# EAGLE design isp (EAGLE 6.1)
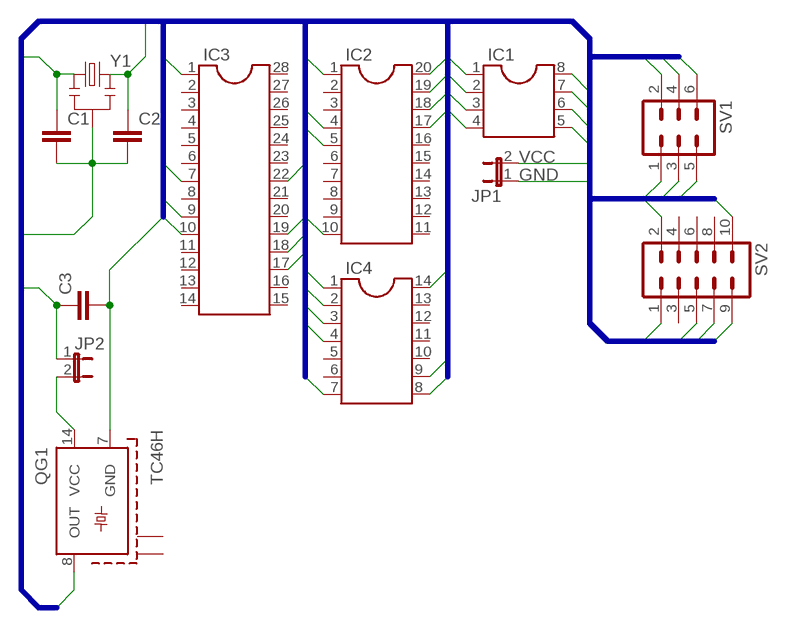
[diagram p0: schematic, sheet 1]

## Parts
C1  C-EU025_050-025X075  [C025_050-025X075]
C2  C-EU025_050-025X075  [C025_050-025X075]
C3  C-EU025-024X044  [C025-024X044]
IC1  DIL8  [DIL08]
IC2  DIL20  [DIL20]
IC3  DIL28-3  [DIL28-3]
IC4  DIL14  [DIL14]
JP1  JP1E  [JP1]
JP2  JP1E  [JP1]
QG1  TC46H  [TC46]
SV1  ML6  [ML6]
SV2  ML10  [ML10]
Y1  RESONATORPTH  [RESONATOR-PTH]

## Nets
GND: C1.2 C2.2 C3.2 IC1.4 IC2.10 IC3.22 IC4.14 JP1.1 QG1.7(GND) SV1.6 SV2.10 Y1.2
MISO: IC1.6 IC2.18 IC3.18 IC4.8 SV1.1 SV2.9
MOSI: IC1.5 IC2.17 IC3.17 IC4.7 SV1.4 SV2.1
N$1: JP2.2 QG1.14(VCC)
RESET: IC1.1 IC2.1 IC3.1 IC4.4 SV1.5 SV2.5
SCK: IC1.7 IC2.19 IC3.19 IC4.9 SV1.3 SV2.7
VCC: C3.1 IC1.8 IC2.20 IC3.7 IC4.1 JP1.2 JP2.1 SV1.2 SV2.2
XTAL1: C1.1 IC1.2 IC2.4 IC3.9 IC4.2 QG1.8(OUT) Y1.1
XTAL2: C2.1 IC1.3 IC2.5 IC3.10 IC4.3 Y1.3
Unconnected: IC2.2 IC2.3 IC2.6 IC2.7 IC2.8 IC2.9 IC2.11 IC2.12 IC2.13 IC2.14 IC2.15 IC2.16 IC3.2 IC3.3 IC3.4 IC3.5 IC3.6 IC3.8 IC3.11 IC3.12 IC3.13 IC3.14 IC3.15 IC3.16 IC3.20 IC3.21 IC3.23 IC3.24 IC3.25 IC3.26 IC3.27 IC3.28 IC4.5 IC4.6 IC4.10 IC4.11 IC4.12 IC4.13 QG1.S@1(S1) QG1.S@2(S2) SV2.3 SV2.4 SV2.6 SV2.8

## Buses
LINE:MOSI,MISO,RESET,SCK,VCC,GND,XTAL1,XTAL2

## Library data of the parts
C1-C3 = rcl:C-EU: CAPACITOR, European symbol
IC1 = ic-package:DIL8: Dual In Line / Socket
IC2 = ic-package:DIL20: Dual In Line / Socket
IC3 = ic-package:DIL28: Dual In Line
IC4 = ic-package:DIL14: Dual In Line / Socket
JP1 JP2 = jumper:JP1E: JUMPER
QG1 = crystal:TC46: Temperature Compensated Xtal Oscillator HCMOS, Clipped Sine Wave or Sine Wave Compatible Source: www.pletronics.com .. tc4.pdf; OC_FARNELL: unknown; OC_NEWARK: unknown
SV1 = con-harting-ml:ML6: HARTING
SV2 = con-harting-ml:ML10: HARTING
Y1 = SparkFun-FreqCtrl:RESONATOR: Resonator Small SMD resonator. Used, eg, on the Arduino Pro/ Pro Mini boards. 8MHz- XTAL-08895 16MHz- XTAL-08900

## Board
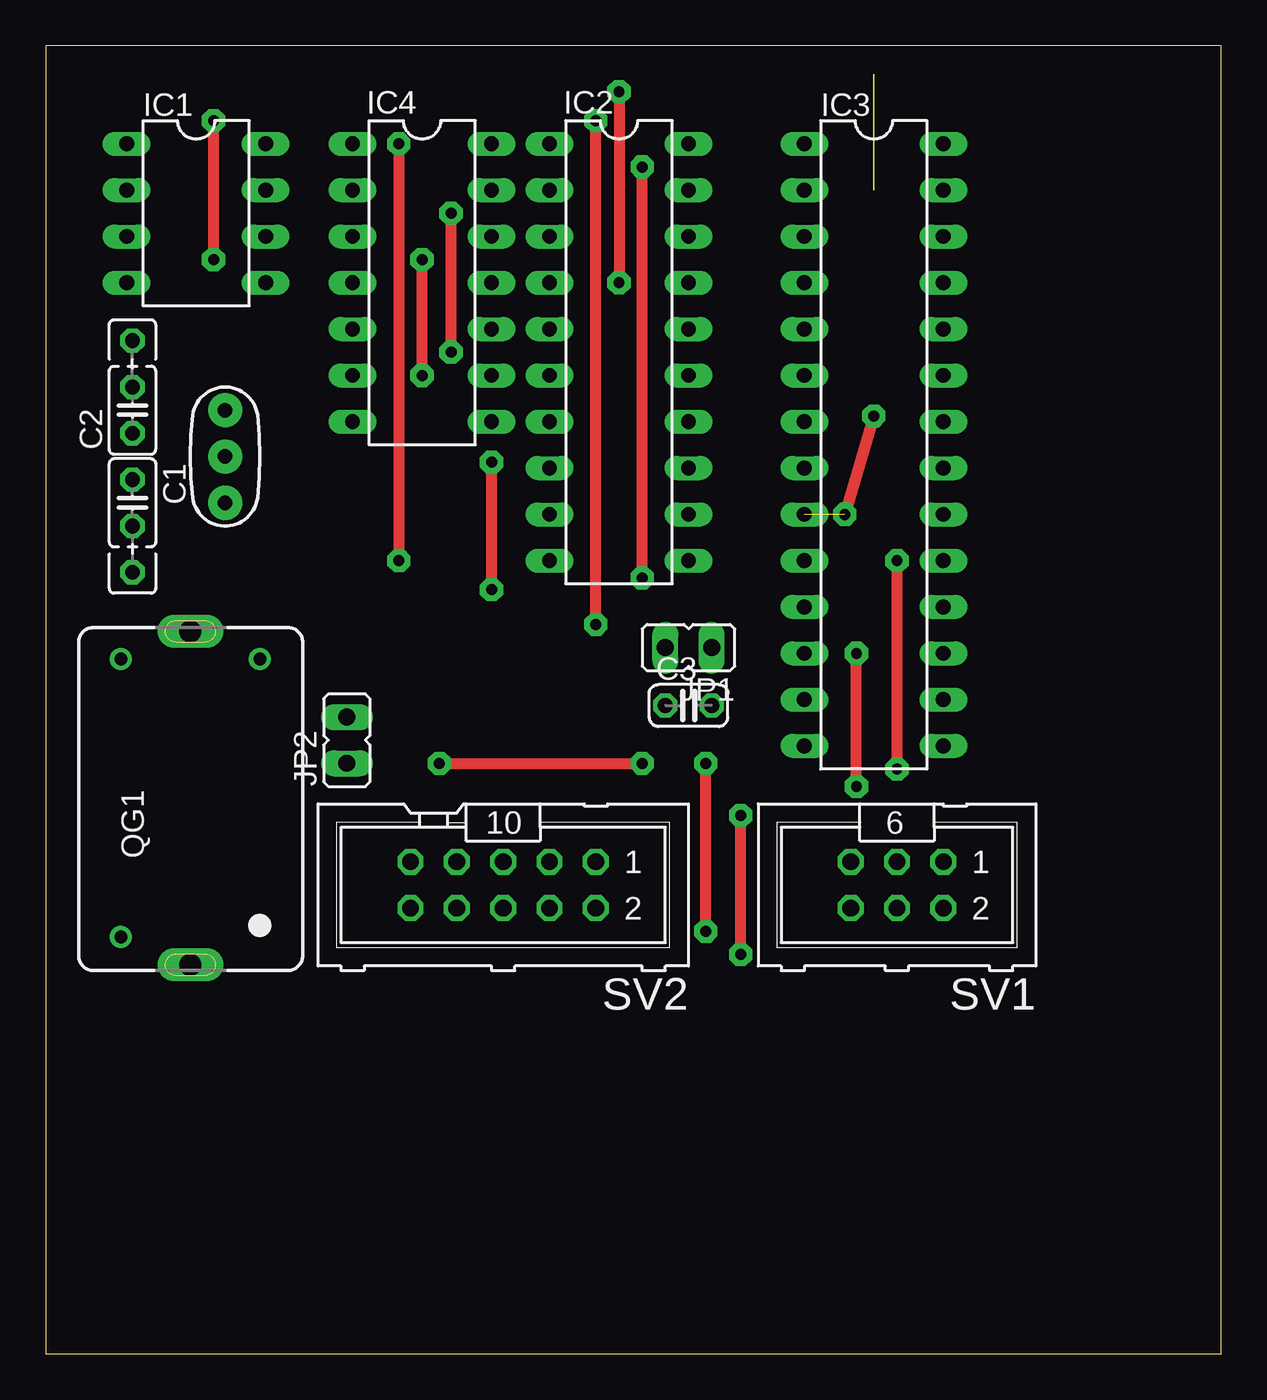
[diagram p1: board, top side]
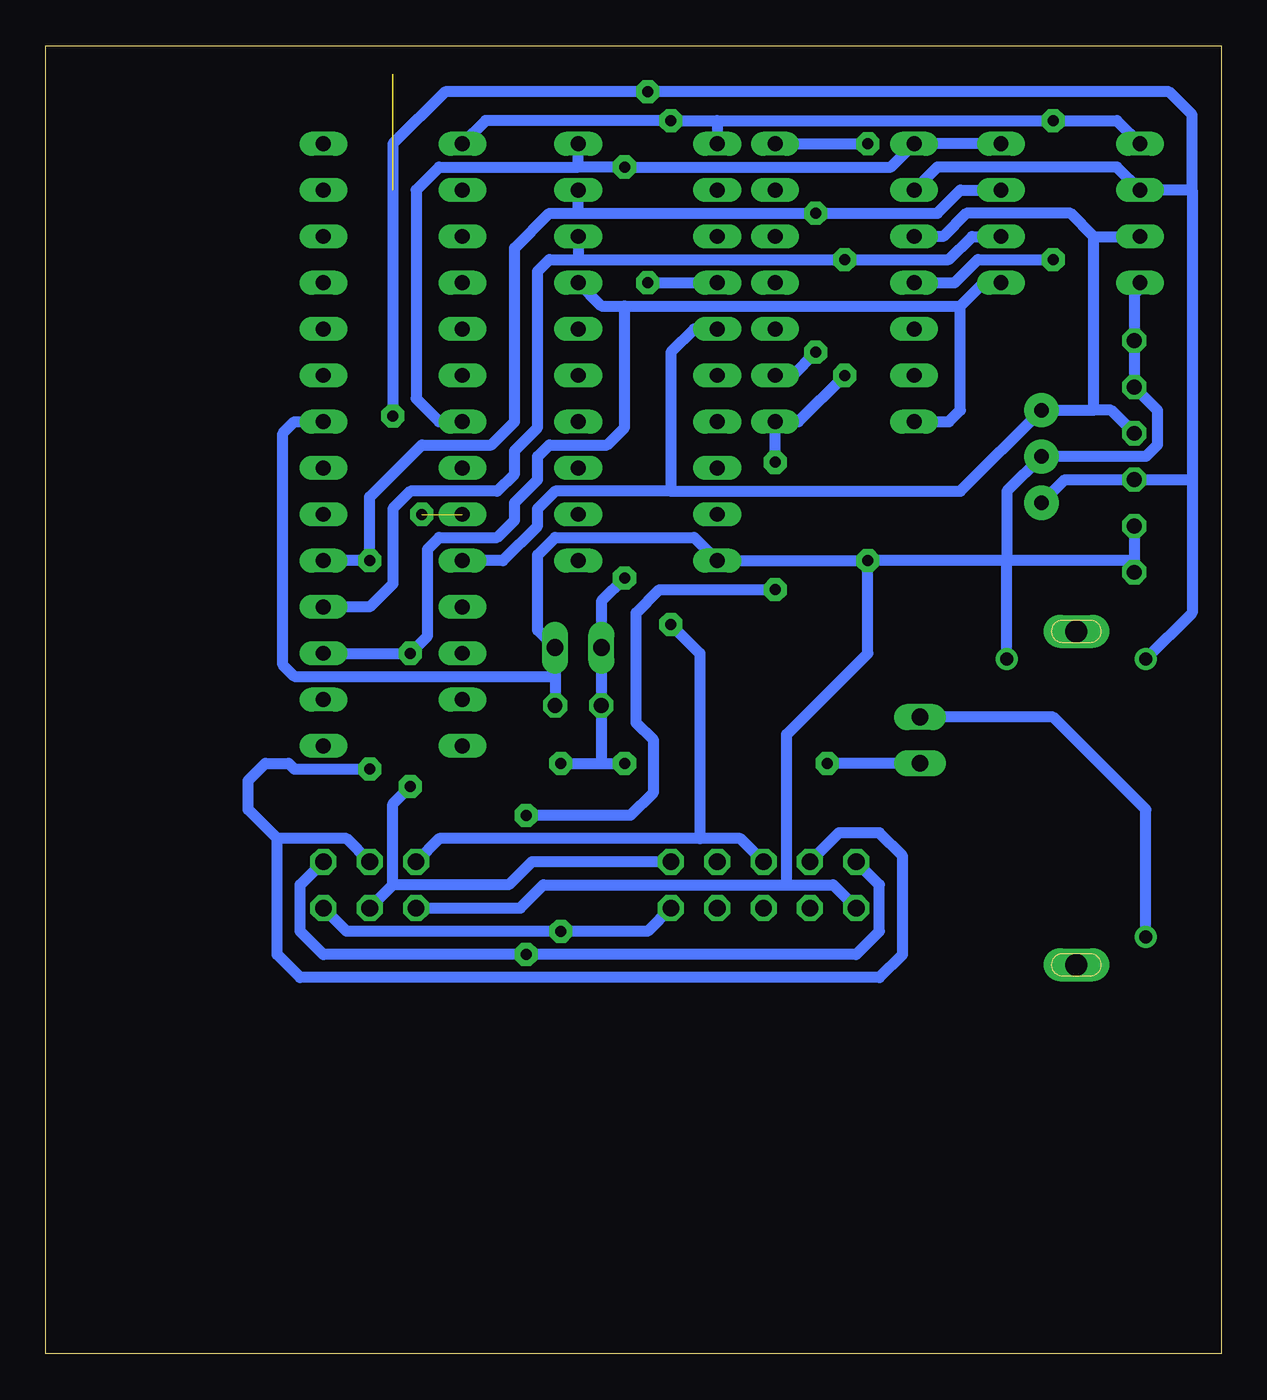
[diagram p2: board, bottom side, seen from below]

Size 64.44 x 71.75 mm. Coordinates in mm from the lower left corner, seen from the top.
Outline: 0,0 64.44,0 64.44,71.75 0,71.75 0,0
Copper layers (1*16): Top 0.035mm / dielectric 1.5mm / Bottom 0.035mm
Design rules: minimum track width 10mil, minimum drill 24mil, track to track 12mil, track to pad 12mil, pad to pad 12mil, via to via 12mil, smd to smd 10mil, copper to edge 12mil, drill to drill 12mil, minimum pad ring 10mil, minimum via ring 10mil, stop-mask expansion 4mil, vias tented up to drill 0mil, thermal gap 12mil

### Footprints (pad centres in the part's own frame; a part is rotated, then mirrored left to right if it is on the bottom)
C025_050-025X075 = drill 0.813 octagon: 1 -1.27,0; 2 1.27,0; 3 3.81,0
C025-024X044 = drill 0.813 octagon: 1 -1.27,0; 2 1.27,0
DIL08 = drill 0.813 long: 1 -3.81,-3.81; 2 -1.27,-3.81; 3 1.27,-3.81; 4 3.81,-3.81; 5 3.81,3.81; 6 1.27,3.81; 7 -1.27,3.81; 8 -3.81,3.81
DIL20 = drill 0.813 long: 1 -11.43,-3.81; 2 -8.89,-3.81; 3 -6.35,-3.81; 4 -3.81,-3.81; 5 -1.27,-3.81; 6 1.27,-3.81; 7 3.81,-3.81; 8 6.35,-3.81; 9 8.89,-3.81; 10 11.43,-3.81; 11 11.43,3.81; 12 8.89,3.81; 13 6.35,3.81; 14 3.81,3.81; 15 1.27,3.81; 16 -1.27,3.81; 17 -3.81,3.81; 18 -6.35,3.81; 19 -8.89,3.81; 20 -11.43,3.81
DIL28-3 = drill 0.813 long: 1 -16.51,-3.81; 2 -13.97,-3.81; 3 -11.43,-3.81; 4 -8.89,-3.81; 5 -6.35,-3.81; 6 -3.81,-3.81; 7 -1.27,-3.81; 8 1.27,-3.81; 9 3.81,-3.81; 10 6.35,-3.81; 11 8.89,-3.81; 12 11.43,-3.81; 13 13.97,-3.81; 14 16.51,-3.81; 15 16.51,3.81; 16 13.97,3.81; 17 11.43,3.81; 18 8.89,3.81; 19 6.35,3.81; 20 3.81,3.81; 21 1.27,3.81; 22 -1.27,3.81; 23 -3.81,3.81; 24 -6.35,3.81; 25 -8.89,3.81; 26 -11.43,3.81; 27 -13.97,3.81; 28 -16.51,3.81
DIL14 = drill 0.813 long: 1 -7.62,-3.81; 2 -5.08,-3.81; 3 -2.54,-3.81; 4 0,-3.81; 5 2.54,-3.81; 6 5.08,-3.81; 7 7.62,-3.81; 8 7.62,3.81; 9 5.08,3.81; 10 2.54,3.81; 11 0,3.81; 12 -2.54,3.81; 13 -5.08,3.81; 14 -7.62,3.81
JP1 = drill 0.914 long: 1 0,-1.27; 2 0,1.27
TC46 = drill 0.7 pad 1.016: 7 7.62,-3.81; 8 7.62,3.81; 14 -7.62,3.81 | drill 1.2 pad 1.6 long: S@1 -9.144,0 | drill 1.2 pad 1.5 long: S@2 9.144,0
ML6 = drill 0.914 octagon: 1 -2.54,-1.27; 2 -2.54,1.27; 3 0,-1.27; 4 0,1.27; 5 2.54,-1.27; 6 2.54,1.27
ML10 = drill 0.914 octagon: 1 -5.08,-1.27; 2 -5.08,1.27; 3 -2.54,-1.27; 4 -2.54,1.27; 5 0,-1.27; 6 0,1.27; 7 2.54,-1.27; 8 2.54,1.27; 9 5.08,-1.27; 10 5.08,1.27
RESONATOR-PTH = drill 0.8 pad 1.88: 1 -2.54,0; 2 0,0; 3 2.54,0

### Placement (x,y rotation side)
C1  4.76,46.67 270 top
C2  4.76,51.75 90 top
C3  35.24,35.56 0 top
IC1  8.26,62.55 270 top
IC2  31.43,54.93 270 top
IC3  45.4,49.85 270 top
IC4  20.64,58.74 270 top
JP1  35.24,38.73 90 top
JP2  16.51,33.66 0 top
QG1  7.94,30.48 90 top
SV1  46.67,25.72 180 top
SV2  25.08,25.72 180 top
Y1  9.84,49.21 90 top

### Tracks (layer width: path | path; a pad name or v marks a point on that pad's centre or on a via)
GND  (via drill 0.6 pad 1.27)
  Top 0.61: v19.37,66.36 v19.37,43.5
  Bottom 0.61: SV2.10 21.27,25.72 23.81,25.72 | SV1.6 38.42,24.45 37.15,25.72 23.81,25.72 | IC1.4 4.13,58.74 4.76,58.1 C2.2 3.49,51.75 3.49,49.85 4.13,49.21 Y1.2 11.75,47.31 11.75,43.5 | v19.37,43.5 IC2.10 28.89,44.77 36.51,44.77 37.47,43.81 37.47,39.69 JP1.1 36.51,37.15 | IC4.14 v19.37,66.36 | 11.75,43.5 v19.37,43.5 | C1.2 4.76,43.5 | 4.76,42.86 4.76,43.5 | 4.76,43.5 11.75,43.5 | QG1.7 11.75,43.5 | 36.51,37.15 C3.2 | IC3.22 50.8,51.12 51.44,50.48 51.44,37.78 50.8,37.15 36.51,37.15 | 23.81,25.72 23.81,33.97 19.37,38.42 v19.37,43.5
MISO  (via drill 0.6 pad 1.27)
  Top 0.61: v38.1,21.91 v38.1,29.53 | v20.64,53.66 v20.64,60.01 | v24.45,41.91 v24.45,48.89
  Bottom 0.61: 35.24,60.01 36.83,60.01 37.47,59.37 37.47,50.8 38.73,49.53 38.73,48.26 39.69,47.31 44.45,47.31 45.4,46.36 45.4,42.23 46.67,40.96 IC3.18 | 35.24,60.01 v20.64,60.01 14.92,60.01 13.65,61.28 IC1.6 | SV2.9 18.73,25.72 18.73,23.18 20,21.91 v38.1,21.91 49.21,21.91 50.48,23.18 50.48,25.72 SV1.1 | v20.64,53.66 23.18,51.12 IC4.8 v24.45,48.89 | v24.45,41.91 30.8,41.91 32.07,40.64 32.07,34.61 31.11,33.66 31.11,30.8 32.38,29.53 v38.1,29.53 | IC2.18 35.24,60.01
MOSI  (via drill 0.6 pad 1.27)
  Top 0.61: v44.45,31.12 v44.45,38.42
  Bottom 0.61: 32.7,57.47 33.97,57.47 IC2.17 | 32.7,57.47 14.29,57.47 | 45.4,25.72 39.05,25.72 37.78,26.99 SV2.1 | 45.4,25.72 45.4,30.16 v44.45,31.12 | 45.4,25.72 SV1.4 | 14.29,57.47 13.02,58.74 IC1.5 | IC4.7 14.92,51.12 14.29,51.75 14.29,57.47 | IC3.17 v44.45,38.42 43.5,39.37 43.5,44.13 42.86,44.77 39.69,44.77 38.73,45.72 38.73,46.67 37.47,47.94 37.47,49.21 36.83,49.85 33.66,49.85 32.7,50.8 32.7,57.47
N$1
  Bottom 0.61: QG1.14 4.13,29.84 9.21,34.92 JP2.2
RESET  (via drill 0.6 pad 1.27)
  Top 0.61: v30.16,40 v30.16,67.63 | v9.21,60.01 v9.21,67.63
  Bottom 0.61: IC1.1 5.71,67.63 v9.21,67.63 27.62,67.63 | 27.62,67.63 v30.16,67.63 40.32,67.63 IC3.1 | 27.62,67.63 IC2.1 | 28.57,28.26 26.35,28.26 SV2.5 | 28.57,28.26 42.86,28.26 SV1.5 | IC4.4 14.61,58.74 13.34,60.01 v9.21,60.01 | v30.16,40 28.57,38.42 28.57,28.26
SCK  (via drill 0.6 pad 1.27)
  Top 0.61: v46.67,32.07 v46.67,43.5 | v22.23,54.93 v22.23,62.55
  Bottom 0.61: 51.75,28.26 51.75,21.91 50.48,20.64 18.73,20.64 17.46,21.91 17.46,27.3 18.73,28.57 20.95,28.57 SV2.7 | IC3.19 v46.67,43.5 46.67,46.99 43.81,49.85 40.01,49.85 38.73,51.12 38.73,60.64 36.83,62.55 35.24,62.55 | SV1.3 47.94,28.26 51.75,28.26 | 35.24,62.55 v22.23,62.55 15.56,62.55 14.29,63.82 IC1.7 | IC4.9 23.5,53.66 v22.23,54.93 | 51.75,28.26 53.34,29.84 53.34,31.43 52.39,32.38 51.12,32.38 50.8,32.07 v46.67,32.07 | 35.24,62.55 IC2.19
VCC  (via drill 0.6 pad 1.27)
  Top 0.61: v36.2,23.18 v36.2,32.38 | v32.7,42.55 v32.7,65.09 | v21.59,32.38 v32.7,32.38
  Bottom 0.61: IC3.7 42.86,51.12 44.13,52.39 44.13,63.82 42.86,65.09 35.24,65.09 | SV2.2 31.43,23.18 v36.2,23.18 47.94,23.18 SV1.2 | IC1.8 IC4.1 18.1,65.09 v32.7,65.09 35.24,65.09 | JP2.1 v21.59,32.38 | v36.2,32.38 33.97,32.38 | 33.97,32.38 v32.7,32.38 | 35.24,65.09 IC2.20 | v32.7,42.55 33.97,41.27 JP1.2 C3.1 33.97,32.38
XTAL1  (via drill 0.6 pad 1.27)  (6 unrouted)
  Top 0.61: v45.4,51.44 v43.81,46.04 | v31.43,69.22 v31.43,58.74
  Bottom 0.61: v45.4,51.44 45.4,66.36 42.55,69.22 v31.43,69.22 2.86,69.22 1.59,67.94 1.59,63.82 | 1.59,63.82 IC1.2 5.71,65.09 15.56,65.09 IC4.2 | v31.43,58.74 IC2.4 | 1.59,63.82 1.59,47.94 | 1.59,47.94 C1.1 8.57,47.94 Y1.1 | QG1.8 1.59,40.64 1.59,47.94
XTAL2
  Bottom 0.61: IC3.10 39.37,43.5 37.47,45.4 37.47,46.36 36.51,47.31 30.16,47.31 | 30.16,47.31 30.16,54.93 28.89,56.2 IC2.5 | C2.1 6.03,51.75 6.99,51.75 | 30.16,47.31 14.29,47.31 Y1.3 6.99,51.75 | 6.99,51.75 6.99,61.28 | 6.99,61.28 IC1.3 | 6.99,61.28 8.26,62.55 13.97,62.55 15.24,61.28 IC4.3